# Altium schematic sheet C40_IMB_Upgrade_block_diagram.SCHDOC
size 812 x 571 mm; DocumentNumber: 2; SheetNumber: 2; SheetTotal: 7; PageSetup: Record=PageOptions|CenterHorizontal=True|CenterVertical=True|PrintScale=0.46|XCorrection=1.00|YCorrection=1.00|PrintKind=0|BorderSize=5000000|LeftOffset=0|BottomOffset=0|Orientation=2|PaperLength=1000|PaperWidth=1000|Scale=100|PaperSource=259|PrintQuality=600|MediaType=1|DitherType=10|PaperKind=Tabloid (11 x 17")|PrintScaleMode=0
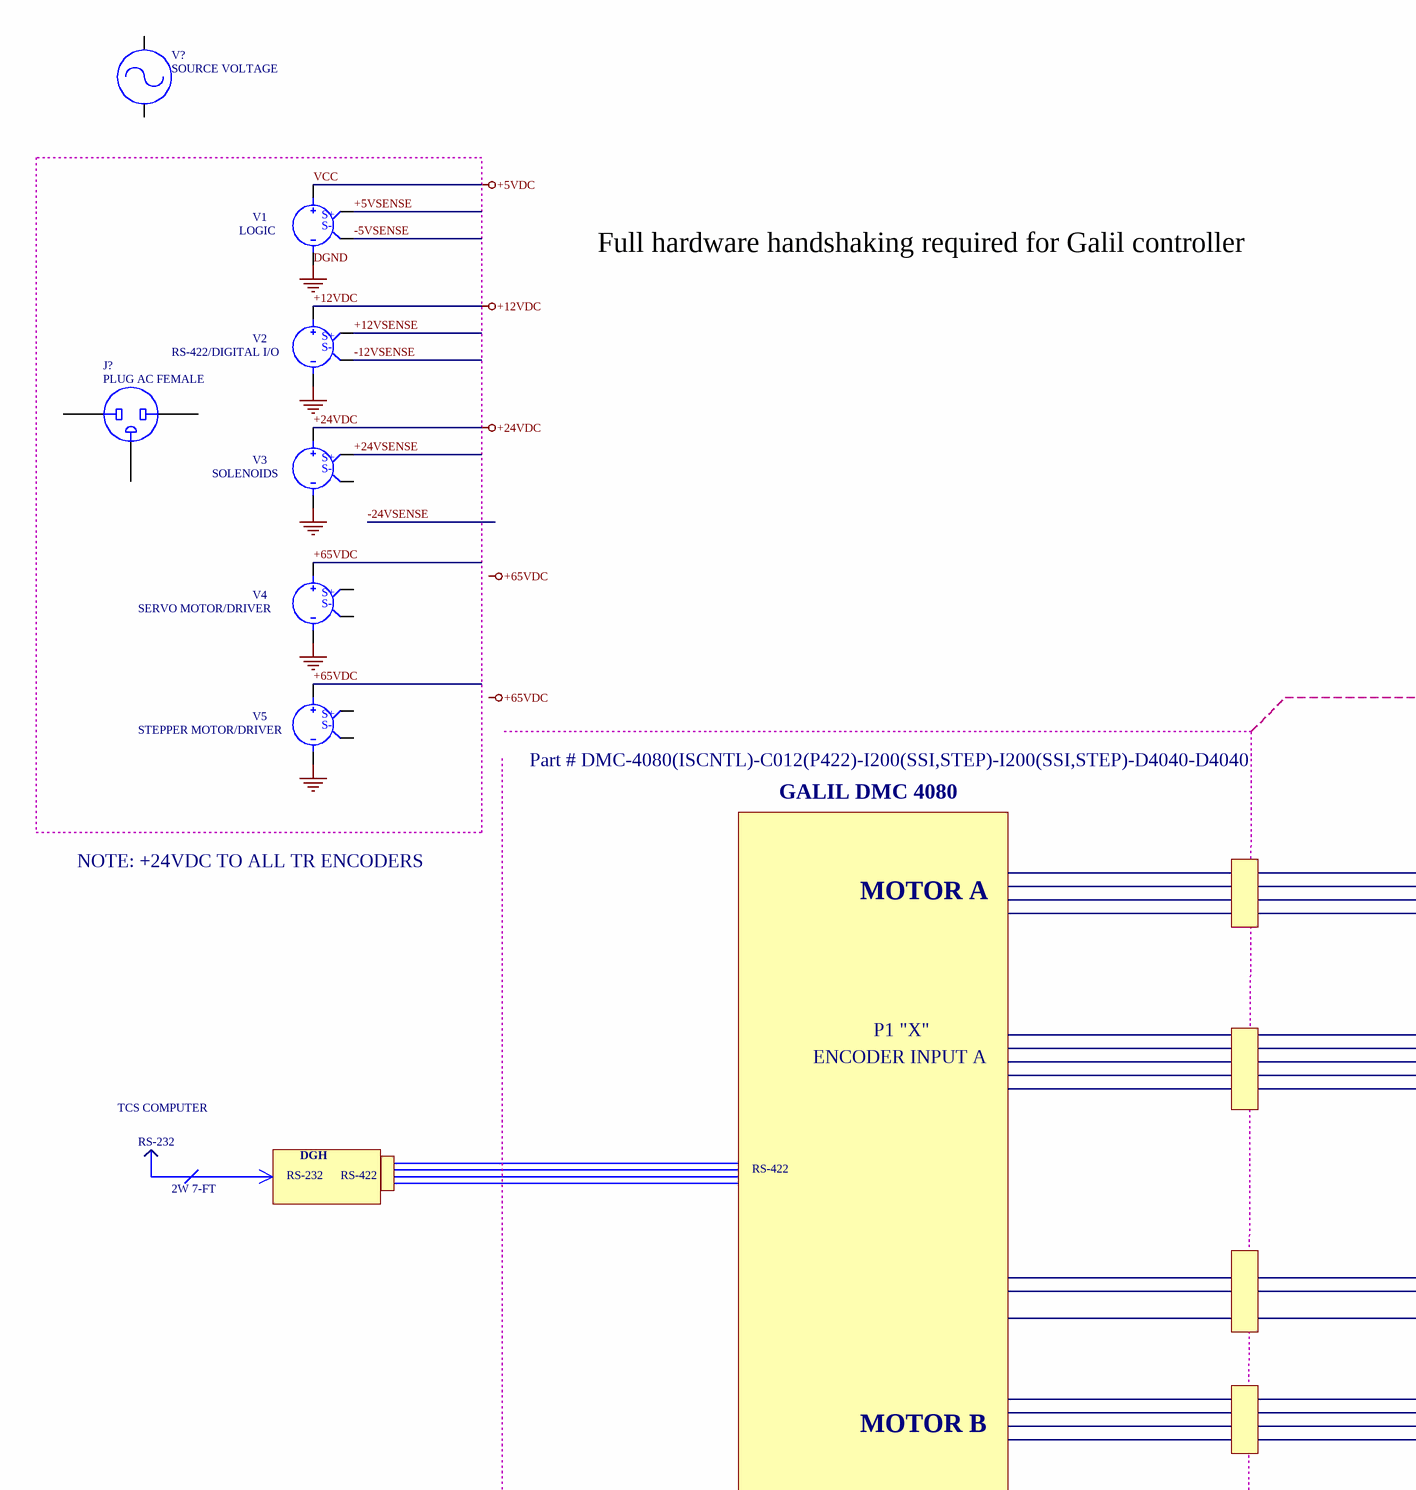
[diagram p0: C40_IMB_Upgrade_block_diagram.SCHDOC, top left]
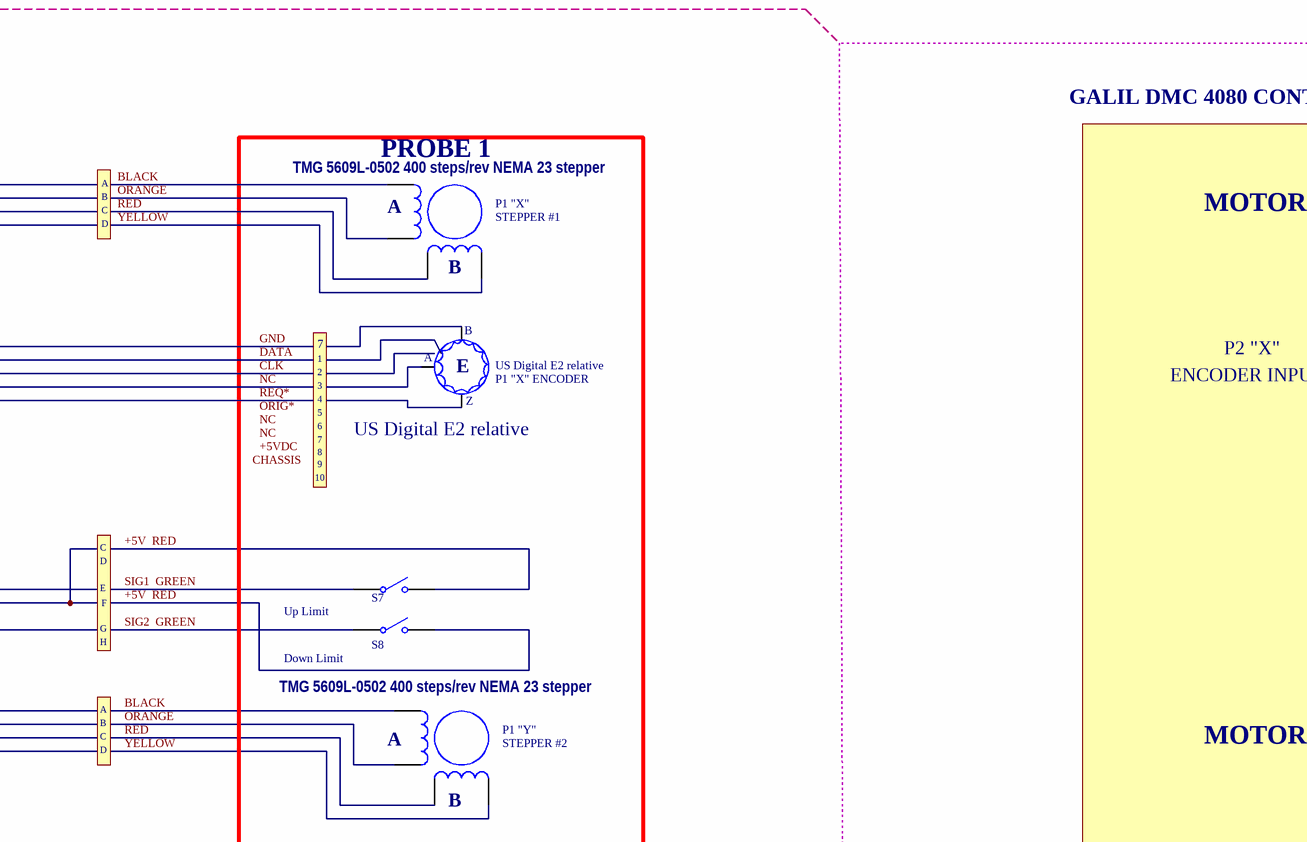
[diagram p1: C40_IMB_Upgrade_block_diagram.SCHDOC, top middle]
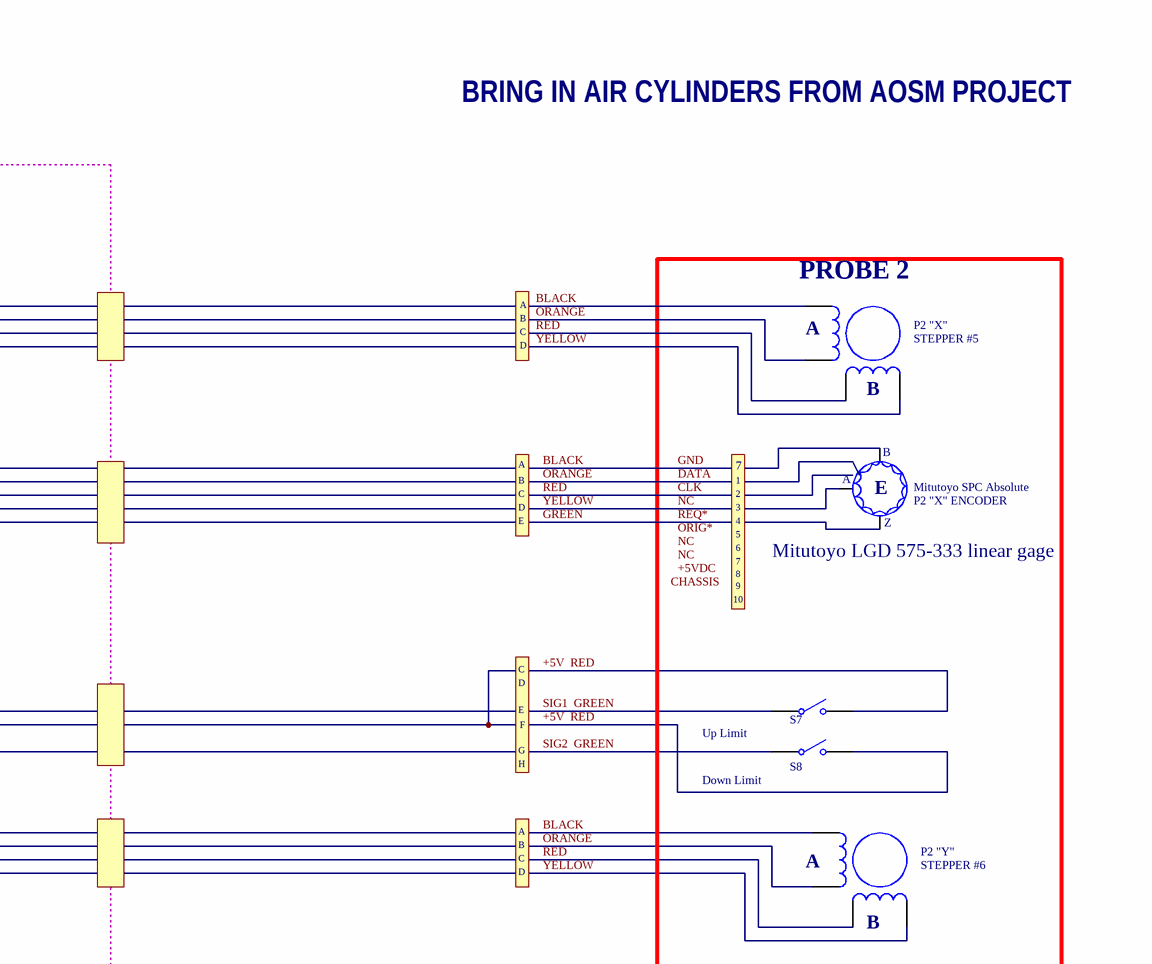
[diagram p2: C40_IMB_Upgrade_block_diagram.SCHDOC, top right]
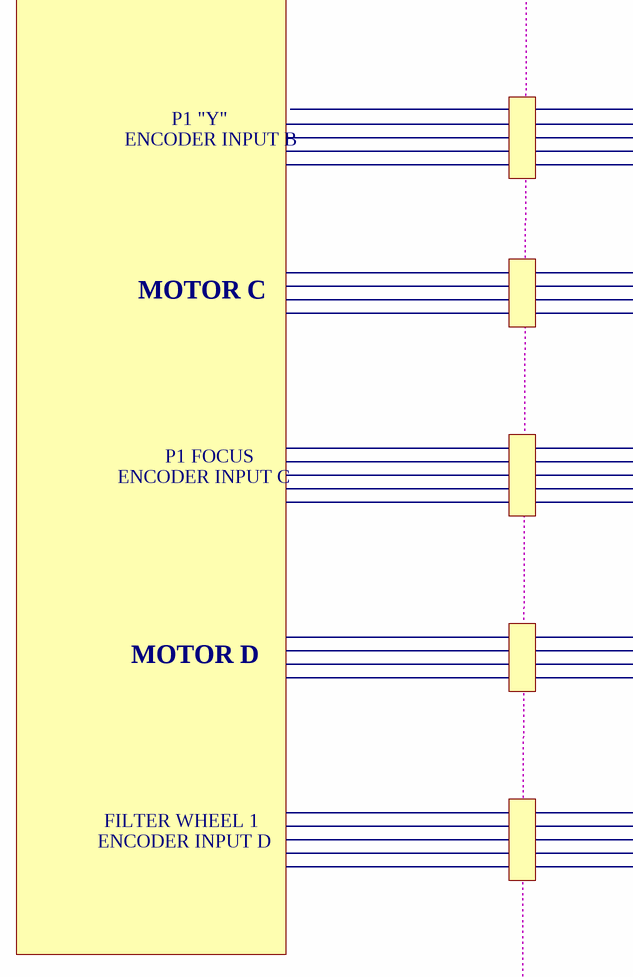
[diagram p3: C40_IMB_Upgrade_block_diagram.SCHDOC, bottom left]
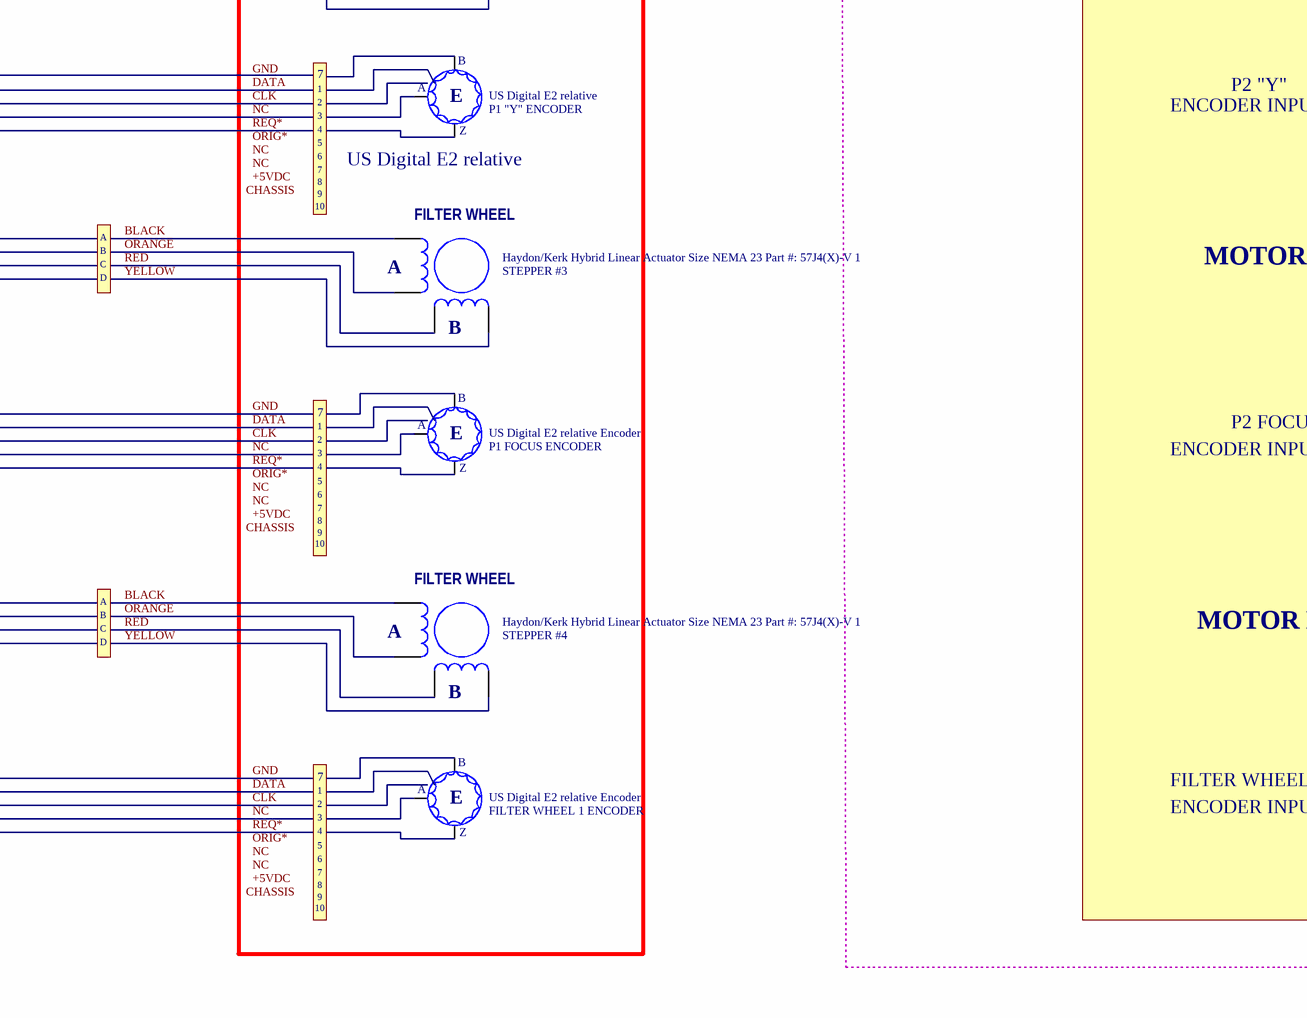
[diagram p4: C40_IMB_Upgrade_block_diagram.SCHDOC, bottom middle]
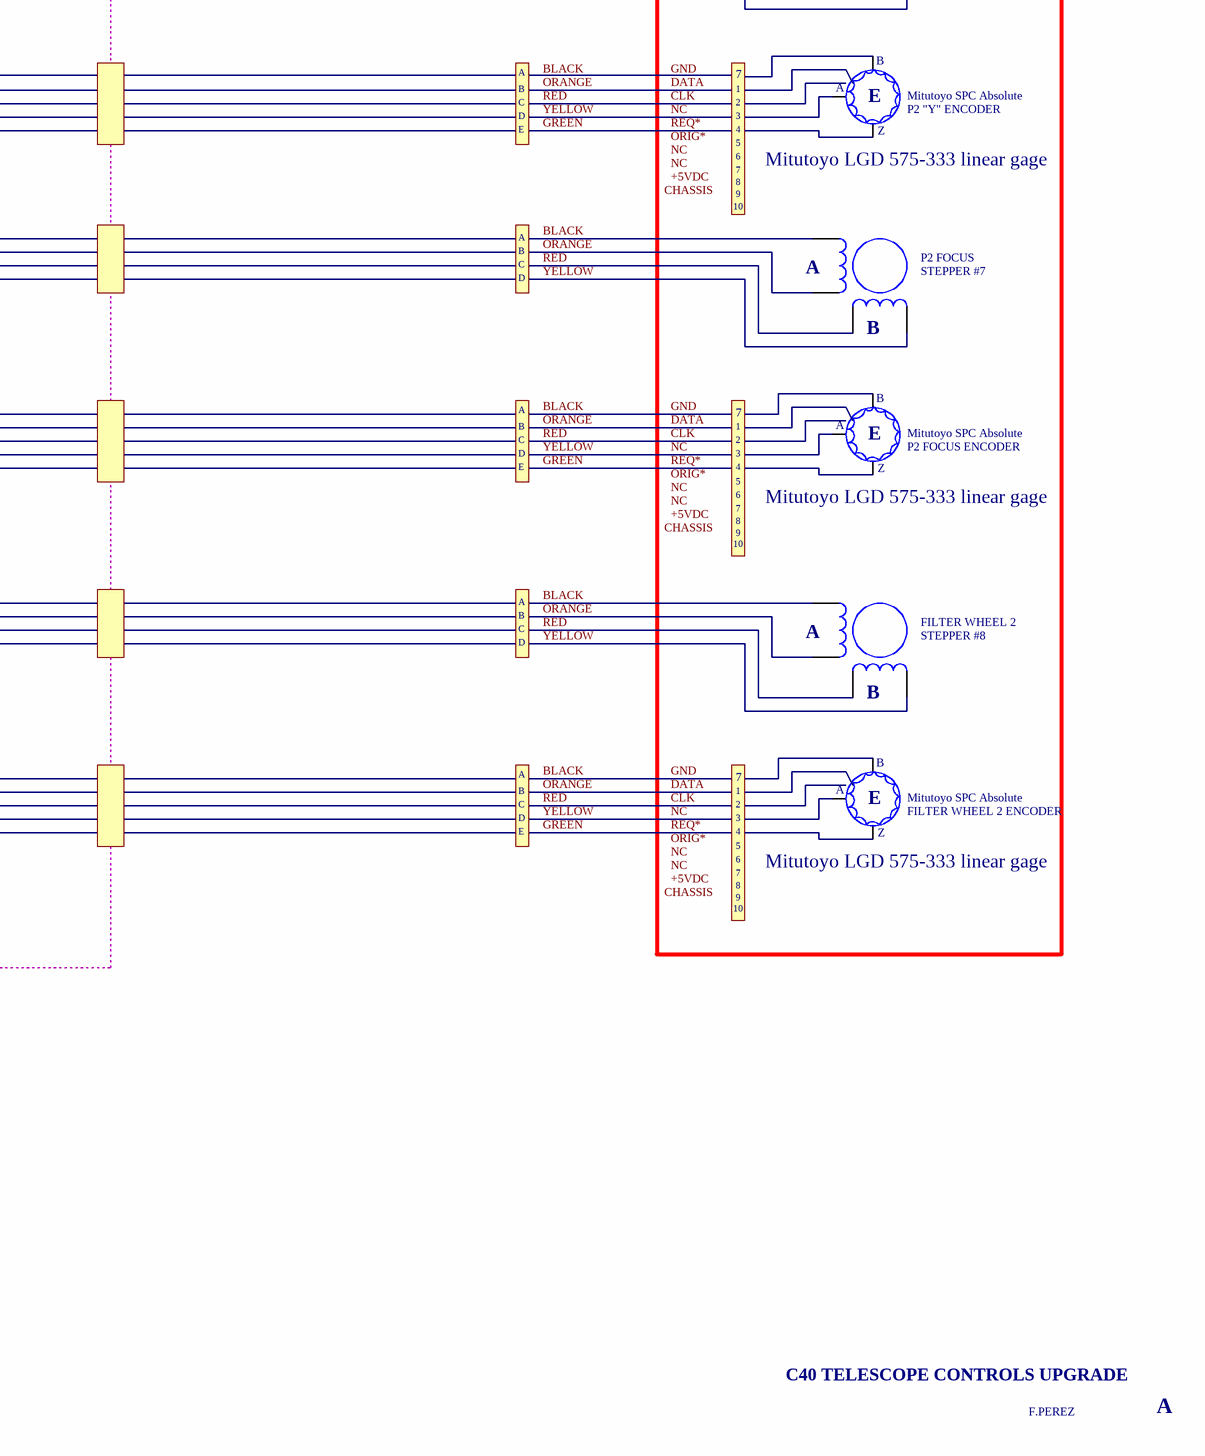
[diagram p5: C40_IMB_Upgrade_block_diagram.SCHDOC, bottom right]

## Parts
(Parts that share a designator on the sheet are numbered #1, #2 ... from top to bottom, then left to right.)
FILTER_WHEEL_2  STEPPER #8
Haydon/Kerk_Hybrid_Linear_Actuator_Size_NEMA_23_Part_#:_57J4(X)-V_1#1  STEPPER #3
Haydon/Kerk_Hybrid_Linear_Actuator_Size_NEMA_23_Part_#:_57J4(X)-V_1#2  STEPPER #4
J?  PLUG AC FEMALE
Mitutoyo_SPC_Absolute#1  P2 "X" ENCODER
Mitutoyo_SPC_Absolute#2  P2 "Y" ENCODER
Mitutoyo_SPC_Absolute#3  P2 FOCUS ENCODER
Mitutoyo_SPC_Absolute#4  FILTER WHEEL 2 ENCODER
P1_"X"  STEPPER #1
P1_"Y"  STEPPER #2
P2_"X"  STEPPER #5
P2_"Y"  STEPPER #6
P2_FOCUS  STEPPER #7
S7#1  Up Limit  [SPST-2]
S7#2  Up Limit  [SPST-2]
S8#1  Down Limit  [SPST-2]
S8#2  Down Limit  [SPST-2]
US_Digital_E2_relative#1  P1 "X" ENCODER
US_Digital_E2_relative#2  P1 "Y" ENCODER
US_Digital_E2_relative_Encoder#1  P1 FOCUS ENCODER
US_Digital_E2_relative_Encoder#2  FILTER WHEEL 1 ENCODER
V1  LOGIC
V2  RS-422/DIGITAL I/O
V3  SOLENOIDS
V4  SERVO MOTOR/DRIVER
V5  STEPPER MOTOR/DRIVER
V?  SOURCE VOLTAGE

## Blocks framed on the sheet
PROBE 1: Haydon/Kerk_Hybrid_Linear_Actuator_Size_NEMA_23_Part_#:_57J4(X)-V_1#1 Haydon/Kerk_Hybrid_Linear_Actuator_Size_NEMA_23_Part_#:_57J4(X)-V_1#2 P1_"X" P1_"Y" S7#1 S8#1 US_Digital_E2_relative#1 US_Digital_E2_relative#2 US_Digital_E2_relative_Encoder#1 US_Digital_E2_relative_Encoder#2
PROBE 2: FILTER_WHEEL_2 Mitutoyo_SPC_Absolute#1-Mitutoyo_SPC_Absolute#4 P2_"X" P2_"Y" P2_FOCUS S7#2 S8#2

## Nets
+12VDC: V2.1
+24VDC: V3.1
+65VDC: V4.1 V5.1
BLACK: FILTER_WHEEL_2.1 Haydon/Kerk_Hybrid_Linear_Actuator_Size_NEMA_23_Part_#:_57J4(X)-V_1#1.1 Haydon/Kerk_Hybrid_Linear_Actuator_Size_NEMA_23_Part_#:_57J4(X)-V_1#2.1 P1_"X".1 P1_"Y".1 P2_"X".1 P2_"Y".1 P2_FOCUS.1 V1.2 V2.2 V3.2 V4.2 V5.2  [also labelled DGND, GND]
VCC: V1.1  [also labelled +5VDC]
+5V  RED: S7#1.2(NO) S7#2.2(NO) S8#1.2(NO) S8#2.2(NO)
+5VSENSE: V1.3(S+)
+12VSENSE: V2.3(S+)
+24VSENSE: V3.3(S+)
-5VSENSE: V1.4(S-)
-12VSENSE: V2.4(S-)
CLK: FILTER_WHEEL_2.4 Haydon/Kerk_Hybrid_Linear_Actuator_Size_NEMA_23_Part_#:_57J4(X)-V_1#1.4 Haydon/Kerk_Hybrid_Linear_Actuator_Size_NEMA_23_Part_#:_57J4(X)-V_1#2.4 P1_"X".4 P1_"Y".4 P2_"X".4 P2_"Y".4 P2_FOCUS.4  [also labelled RED]
DATA: FILTER_WHEEL_2.3 Haydon/Kerk_Hybrid_Linear_Actuator_Size_NEMA_23_Part_#:_57J4(X)-V_1#1.3 Haydon/Kerk_Hybrid_Linear_Actuator_Size_NEMA_23_Part_#:_57J4(X)-V_1#2.3 P1_"X".3 P1_"Y".3 P2_"X".3 P2_"Y".3 P2_FOCUS.3  [also labelled ORANGE]
NC: FILTER_WHEEL_2.6 Haydon/Kerk_Hybrid_Linear_Actuator_Size_NEMA_23_Part_#:_57J4(X)-V_1#1.6 Haydon/Kerk_Hybrid_Linear_Actuator_Size_NEMA_23_Part_#:_57J4(X)-V_1#2.6 P1_"X".6 P1_"Y".6 P2_"X".6 P2_"Y".6 P2_FOCUS.6  [also labelled YELLOW]
SIG1  GREEN: S7#1.1(COMMON) S7#2.1(COMMON)
SIG2  GREEN: S8#1.1(COMMON) S8#2.1(COMMON)

Not connected (* = marked no-connect by the designer): J? A B GND; Mitutoyo_SPC_Absolute#1 1 2 3; Mitutoyo_SPC_Absolute#2 1 2 3; Mitutoyo_SPC_Absolute#3 1 2 3; Mitutoyo_SPC_Absolute#4 1 2 3; US_Digital_E2_relative#1 1 2 3; US_Digital_E2_relative#2 1 2 3; US_Digital_E2_relative_Encoder#1 1 2 3; US_Digital_E2_relative_Encoder#2 1 2 3; V3 4(S-); V4 3(S+) 4(S-); V5 3(S+) 4(S-); V? 1 2

## Notes on the sheet
- Full hardware handshaking required for Galil controller
- BRING IN AIR CYLINDERS FROM AOSM PROJECT
- Part # DMC-4080(ISCNTL)-C012(P422)-I200(SSI,STEP)-I200(SSI,STEP)-D4040-D4040
- GALIL DMC 4080
- (near P1_"X") TMG 5609L-0502 400 steps/rev NEMA 23 stepper
- GALIL DMC 4080 CONTINUED
- NOTE: +24VDC TO ALL TR ENCODERS
- MOTOR A
- D
- C
- A
- B
- (near P1_"X") A
- MOTOR E
- (near P2_"X") A
- (near P1_"X") B
- (near P2_"X") B
- P1 "X"
- 7
- 1
- 2
- P2 "X"
- TCS COMPUTER
- ENCODER INPUT A
- 4
- 3
- 5
- 6
- (near US_Digital_E2_relative#1) US Digital E2 relative
- ENCODER INPUT E
- E
- (near Mitutoyo_SPC_Absolute#1) Mitutoyo LGD 575-333 linear gage
- RS-232
- 2W 7-FT
- DGH
- RS-422
- 10
- 8
- 9
- G
- H
- F
- (near P1_"Y") TMG 5609L-0502 400 steps/rev NEMA 23 stepper
- MOTOR B
- (near P1_"Y") A
- MOTOR F
- (near P2_"Y") A
- (near P1_"Y") B
- (near P2_"Y") B
- P1 "Y"
- P2 "Y"
- ENCODER INPUT B
- (near US_Digital_E2_relative#2) US Digital E2 relative
- ENCODER INPUT F
- (near Mitutoyo_SPC_Absolute#2) Mitutoyo LGD 575-333 linear gage
- (near Haydon/Kerk_Hybrid_Linear_Actuator_Size_NEMA_23_Part_#:_57J4(X)-V_1#1) FILTER WHEEL
- MOTOR C
- (near Haydon/Kerk_Hybrid_Linear_Actuator_Size_NEMA_23_Part_#:_57J4(X)-V_1#1) A
- MOTOR G
- (near P2_FOCUS) A
- (near Haydon/Kerk_Hybrid_Linear_Actuator_Size_NEMA_23_Part_#:_57J4(X)-V_1#1) B
- (near P2_FOCUS) B
- P1 FOCUS
- P2 FOCUS
- ENCODER INPUT C
- ENCODER INPUT G
- (near Mitutoyo_SPC_Absolute#3) Mitutoyo LGD 575-333 linear gage
- MOTOR D
- (near Haydon/Kerk_Hybrid_Linear_Actuator_Size_NEMA_23_Part_#:_57J4(X)-V_1#2) A
- (near Haydon/Kerk_Hybrid_Linear_Actuator_Size_NEMA_23_Part_#:_57J4(X)-V_1#2) FILTER WHEEL
- MOTOR H
- (near FILTER_WHEEL_2) A
- (near Haydon/Kerk_Hybrid_Linear_Actuator_Size_NEMA_23_Part_#:_57J4(X)-V_1#2) B
- (near FILTER_WHEEL_2) B
- ENCODER INPUT D
- FILTER WHEEL 1
- ENCODER INPUT H
- FILTER WHEEL 2
- (near Mitutoyo_SPC_Absolute#4) Mitutoyo LGD 575-333 linear gage
- C40 TELESCOPE CONTROLS UPGRADE
- F.PEREZ
- Labels drawn without touching a wire or pin: +5VDC, +65VDC, BLACK, CHASSIS, GND, NC, ORIG*
- Carnegie Institution of Washington
- Pasadena, California 91101
- 813 Santa Barbara Street
- The Observatories
- PHONE (626) 577-1122               FAX (626) 795-8136
- Title:
- OCIW
- Size:
- Date:
- File:
- Scale:
- Drawn By:
- Checked By:
- A. BAGISH
- alanb
- Revision:
- Sheet          of
- (in symbol ENCODER) B; A; E; Z

## Library data of the parts
FILTER_WHEEL_2 Haydon/Kerk_Hybrid_Linear_Actuator_Size_NEMA_23_Part_#:_57J4(X)-V_1#1 Haydon/Kerk_Hybrid_Linear_Actuator_Size_NEMA_23_Part_#:_57J4(X)-V_1#2 P1_"X" P1_"Y" P2_"X" P2_"Y" P2_FOCUS = MOTOR STEPPER
Mitutoyo_SPC_Absolute#1-Mitutoyo_SPC_Absolute#4 US_Digital_E2_relative#1 US_Digital_E2_relative#2 US_Digital_E2_relative_Encoder#1 US_Digital_E2_relative_Encoder#2 = ENCODER
S7#1 S7#2 S8#1 S8#2 = SW-SPST: Single-Pole, Single-Throw Switch; Published: 24-Mar-1999; LatestRevisionDate: 17-Jul-2002; LatestRevisionNote: Re-released for DXP Platform.; Publisher: Altium Limited
V1-V5 = SOURCE VOLTAGE